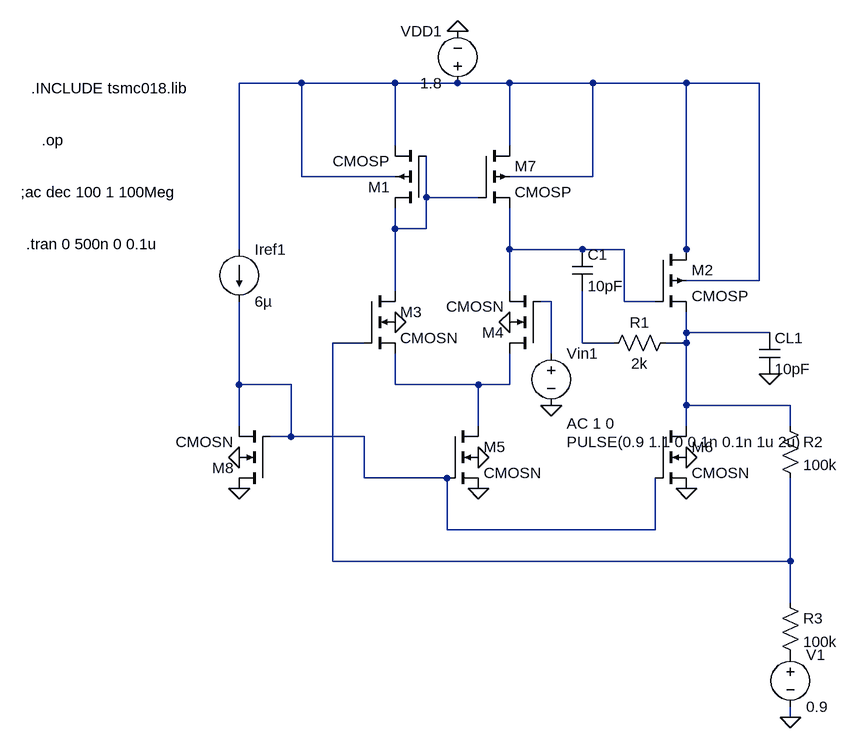
[diagram p0: schematic 2 stage ota step response design.asc]
2 stage ota step response design.asc, the LTspice schematic file:
Version 4
SHEET 1 880 680
WIRE -592 -784 -688 -784
WIRE -448 -784 -592 -784
WIRE -352 -784 -448 -784
WIRE -272 -784 -352 -784
WIRE -144 -784 -272 -784
WIRE 0 -784 -144 -784
WIRE 112 -784 0 -784
WIRE -448 -688 -448 -784
WIRE -272 -688 -272 -784
WIRE -592 -640 -592 -784
WIRE -448 -640 -592 -640
WIRE -144 -640 -144 -784
WIRE -144 -640 -272 -640
WIRE -400 -608 -400 -672
WIRE -320 -608 -400 -608
WIRE -448 -560 -448 -592
WIRE -400 -560 -400 -608
WIRE -400 -560 -448 -560
WIRE -688 -528 -688 -784
WIRE -272 -528 -272 -592
WIRE -160 -528 -272 -528
WIRE -96 -528 -160 -528
WIRE 0 -528 0 -784
WIRE 0 -512 0 -528
WIRE 112 -480 112 -784
WIRE 112 -480 0 -480
WIRE -448 -464 -448 -560
WIRE -272 -464 -272 -528
WIRE -208 -448 -224 -448
WIRE -96 -448 -96 -528
WIRE -48 -448 -96 -448
WIRE 0 -400 0 -432
WIRE 128 -400 0 -400
WIRE -496 -384 -544 -384
WIRE -160 -384 -160 -464
WIRE -112 -384 -160 -384
WIRE 0 -384 0 -400
WIRE 0 -384 -32 -384
WIRE -208 -368 -208 -448
WIRE -688 -320 -688 -448
WIRE -608 -320 -688 -320
WIRE -448 -320 -448 -368
WIRE -320 -320 -448 -320
WIRE -272 -320 -272 -368
WIRE -272 -320 -320 -320
WIRE 0 -288 0 -384
WIRE 160 -288 0 -288
WIRE -688 -256 -688 -320
WIRE -320 -256 -320 -320
WIRE 0 -256 0 -288
WIRE 160 -256 160 -288
WIRE -608 -240 -608 -320
WIRE -608 -240 -640 -240
WIRE -496 -240 -608 -240
WIRE -496 -176 -496 -240
WIRE -368 -176 -496 -176
WIRE -368 -96 -368 -176
WIRE -48 -96 -48 -176
WIRE -48 -96 -368 -96
WIRE -544 -48 -544 -384
WIRE 160 -48 160 -176
WIRE 160 -48 -544 -48
WIRE 160 16 160 -48
WIRE 160 192 160 176
FLAG -272 -416 0
FLAG -448 -416 0
FLAG -320 -208 0
FLAG -320 -160 0
FLAG 0 -160 0
FLAG 0 -208 0
FLAG -688 -208 0
FLAG 128 -336 0
FLAG -352 -864 0
FLAG -208 -288 0
FLAG -688 -160 0
FLAG 160 192 0
SYMBOL cmosp -400 -592 R180
SYMATTR InstName M1
SYMATTR Value2 l=0.36u w=5.4u
SYMBOL cmosp -48 -528 R0
SYMATTR InstName M2
SYMATTR Value2 l=0.36u w=10.8u
SYMBOL cmosn -496 -464 R0
SYMATTR InstName M3
SYMATTR Value2 l=0.36u w=2.35u
SYMBOL cmosn -224 -368 R180
SYMATTR InstName M4
SYMATTR Value2 l=0.36u w=2.35u
SYMBOL cmosn -368 -256 R0
SYMATTR InstName M5
SYMATTR Value2 l=0.36u w=4.68u
SYMBOL cmosn -48 -256 R0
SYMATTR InstName M6
SYMATTR Value2 l=0.36u w=4.68u
SYMBOL cmosp -320 -688 R0
SYMATTR InstName M7
SYMATTR Value2 l=0.36u w=5.4u
SYMBOL current -688 -528 R0
WINDOW 123 0 0 Left 2
WINDOW 39 0 0 Left 2
SYMATTR InstName Iref1
SYMATTR Value 6µ
SYMBOL cap -176 -528 R0
SYMATTR InstName C1
SYMATTR Value 10pF
SYMBOL res -16 -400 R90
WINDOW 0 0 56 VBottom 2
WINDOW 3 32 56 VTop 2
SYMATTR InstName R1
SYMATTR Value 2k
SYMBOL cmosn -640 -160 R180
SYMATTR InstName M8
SYMATTR Value2 l=0.36u w=0.47u
SYMBOL cap 112 -400 R0
SYMATTR InstName CL1
SYMATTR Value 10pF
SYMBOL voltage -352 -768 R180
WINDOW 0 24 96 Left 2
WINDOW 3 24 16 Left 2
SYMATTR InstName VDD1
SYMATTR Value 1.8
SYMBOL voltage -208 -384 R0
WINDOW 123 24 124 Left 2
WINDOW 39 0 0 Left 2
WINDOW 3 24 152 Left 2
SYMATTR Value2 AC 1 0
SYMATTR Value PULSE(0.9 1.1 0 0.1n 0.1n 1u 2u)
SYMATTR InstName Vin1
SYMBOL res 144 -272 R0
SYMATTR InstName R2
SYMATTR Value 100k
SYMBOL res 144 0 R0
SYMATTR InstName R3
SYMATTR Value 100k
SYMBOL voltage 160 80 R0
SYMATTR InstName V1
SYMATTR Value 0.9
TEXT -1008 -776 Left 2 !.INCLUDE tsmc018.lib
TEXT -992 -696 Left 2 !.op
TEXT -1024 -616 Left 2 !;ac dec 100 1 100Meg
TEXT -1016 -536 Left 2 !.tran 0 500n 0 0.1u

The netlist it stands for:
* 2 stage ota step response design.asc
M1 N002 N002 N001 N001 CMOSP l=0.36u w=5.4u
M2 N001 N003 N005 N001 CMOSP l=0.36u w=10.8u
M3 N002 N006 N009 0 CMOSN l=0.36u w=2.35u
M4 N009 N004 N003 0 CMOSN l=0.36u w=2.35u
M5 N009 N008 0 0 CMOSN l=0.36u w=4.68u
M6 N005 N008 0 0 CMOSN l=0.36u w=4.68u
M7 N001 N002 N003 N001 CMOSP l=0.36u w=5.4u
Iref1 N001 N008 6µ
C1 N003 N007 10pF
R1 N005 N007 2k
M8 0 N008 N008 0 CMOSN l=0.36u w=0.47u
CL1 N005 0 10pF
VDD1 N001 0 1.8
Vin1 N004 0 PULSE(0.9 1.1 0 0.1n 0.1n 1u 2u) AC 1 0
R2 N005 N006 100k
R3 N006 P001 100k
V1 P001 0 0.9
.model NMOS NMOS
.model PMOS PMOS
.lib standard.mos
.INCLUDE tsmc018.lib
.op
;ac dec 100 1 100Meg
.tran 0 500n 0 0.1u
.backanno
.end